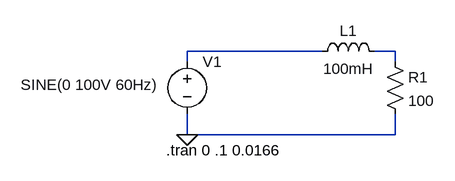
[diagram p0: schematic Conv-A10-PotenciasRL.asc]
Conv-A10-PotenciasRL.asc, the LTspice schematic file:
Version 4
SHEET 1 960 1016
WIRE 176 352 -32 352
WIRE 288 352 256 352
WIRE -32 368 -32 352
WIRE 288 368 288 352
WIRE -32 480 -32 448
WIRE 288 480 288 448
WIRE 288 480 -32 480
FLAG -32 480 0
SYMBOL voltage -32 352 R0
WINDOW 3 -256 51 Left 2
WINDOW 123 0 0 Left 0
WINDOW 39 0 0 Left 0
SYMATTR Value SINE(0 100V 60Hz)
SYMATTR InstName V1
SYMBOL res 272 352 R0
SYMATTR InstName R1
SYMATTR Value 100
SYMBOL ind 160 368 R270
WINDOW 0 32 56 VTop 2
WINDOW 3 5 56 VBottom 2
SYMATTR InstName L1
SYMATTR Value 100mH
TEXT -64 504 Left 2 !.tran 0 .1 0.0166

The netlist it stands for:
* Conv-A10-PotenciasRL.asc
V1 N001 0 SINE(0 100V 60Hz)
R1 N002 0 100
L1 N001 N002 100mH
.tran 0 .1 0.0166
.backanno
.end